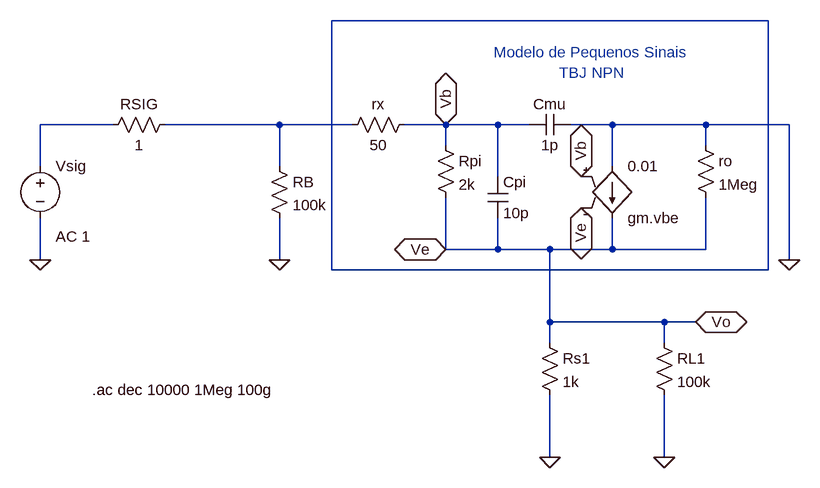
[diagram p0: schematic Coletor_Comum_Altas_Frequencias.asc]
Coletor_Comum_Altas_Frequencias.asc, the LTspice schematic file:
Version 4
SHEET 1 1560 680
WIRE 1040 -80 368 -80
WIRE 32 80 -80 80
WIRE 288 80 112 80
WIRE 400 80 288 80
WIRE 544 80 480 80
WIRE 624 80 544 80
WIRE 672 80 624 80
WIRE 800 80 736 80
WIRE 944 80 800 80
WIRE 1072 80 944 80
WIRE 544 112 544 80
WIRE 944 112 944 80
WIRE -80 144 -80 80
WIRE 288 144 288 80
WIRE 800 144 800 80
WIRE 624 160 624 80
WIRE 544 272 544 192
WIRE 624 272 624 224
WIRE 624 272 544 272
WIRE 704 272 624 272
WIRE 800 272 800 224
WIRE 800 272 704 272
WIRE 944 272 944 192
WIRE 944 272 800 272
WIRE -80 288 -80 224
WIRE 288 288 288 224
WIRE 1072 288 1072 80
WIRE 368 304 368 -80
WIRE 1040 304 1040 -80
WIRE 1040 304 368 304
WIRE 704 384 704 272
WIRE 880 384 704 384
WIRE 928 384 880 384
WIRE 704 416 704 384
WIRE 880 416 880 384
WIRE 704 592 704 496
WIRE 880 592 880 496
FLAG -80 288 0
FLAG 288 288 0
FLAG 752 160 Vb
IOPIN 752 160 BiDir
FLAG 752 208 Ve
IOPIN 752 208 BiDir
FLAG 544 80 Vb
IOPIN 544 80 BiDir
FLAG 544 272 Ve
IOPIN 544 272 BiDir
FLAG 1072 288 0
FLAG 704 592 0
FLAG 928 384 Vo
IOPIN 928 384 BiDir
FLAG 880 592 0
SYMBOL voltage -80 128 R0
WINDOW 123 24 124 Left 2
WINDOW 39 0 0 Left 0
SYMATTR Value2 AC 1
SYMATTR InstName Vsig
SYMATTR Value ""
SYMBOL res 128 64 R90
WINDOW 0 0 56 VBottom 2
WINDOW 3 32 56 VTop 2
SYMATTR InstName RSIG
SYMATTR Value 1
SYMBOL res 272 128 R0
SYMATTR InstName RB
SYMATTR Value 100k
SYMBOL res 928 96 R0
SYMATTR InstName ro
SYMATTR Value 1Meg
SYMBOL res 528 96 R0
SYMATTR InstName Rpi
SYMATTR Value 2k
SYMBOL g2 800 240 M180
SYMATTR InstName gm.vbe
SYMATTR Value 0.01
SYMBOL cap 736 64 R90
WINDOW 0 0 32 VBottom 2
WINDOW 3 32 32 VTop 2
SYMATTR InstName Cmu
SYMATTR Value 1p
SYMBOL cap 608 160 R0
SYMATTR InstName Cpi
SYMATTR Value 10p
SYMBOL res 496 64 R90
WINDOW 0 0 56 VBottom 2
WINDOW 3 32 56 VTop 2
SYMATTR InstName rx
SYMATTR Value 50
SYMBOL res 688 400 R0
SYMATTR InstName Rs1
SYMATTR Value 1k
SYMBOL res 864 400 R0
SYMATTR InstName RL1
SYMATTR Value 100k
TEXT 768 -16 Center 2 ;Modelo de Pequenos Sinais\nTBJ NPN
TEXT 0 488 Left 2 !.ac dec 10000 1Meg 100g

The netlist it stands for:
* Coletor_Comum_Altas_Frequencias.asc
Vsig N002 0 AC 1
RSIG N003 N002 1
RB N003 0 100k
ro 0 Vo 1Meg
Rpi Vb Vo 2k
gm.vbe 0 Vo Vb Vo 0.01
Cmu 0 Vb 1p
Cpi Vb Vo 10p
rx Vb N003 50
Rs1 Vo 0 1k
RL1 Vo 0 100k
* Modelo de Pequenos Sinais
* TBJ NPN
.ac dec 10000 1Meg 100g
.backanno
.end